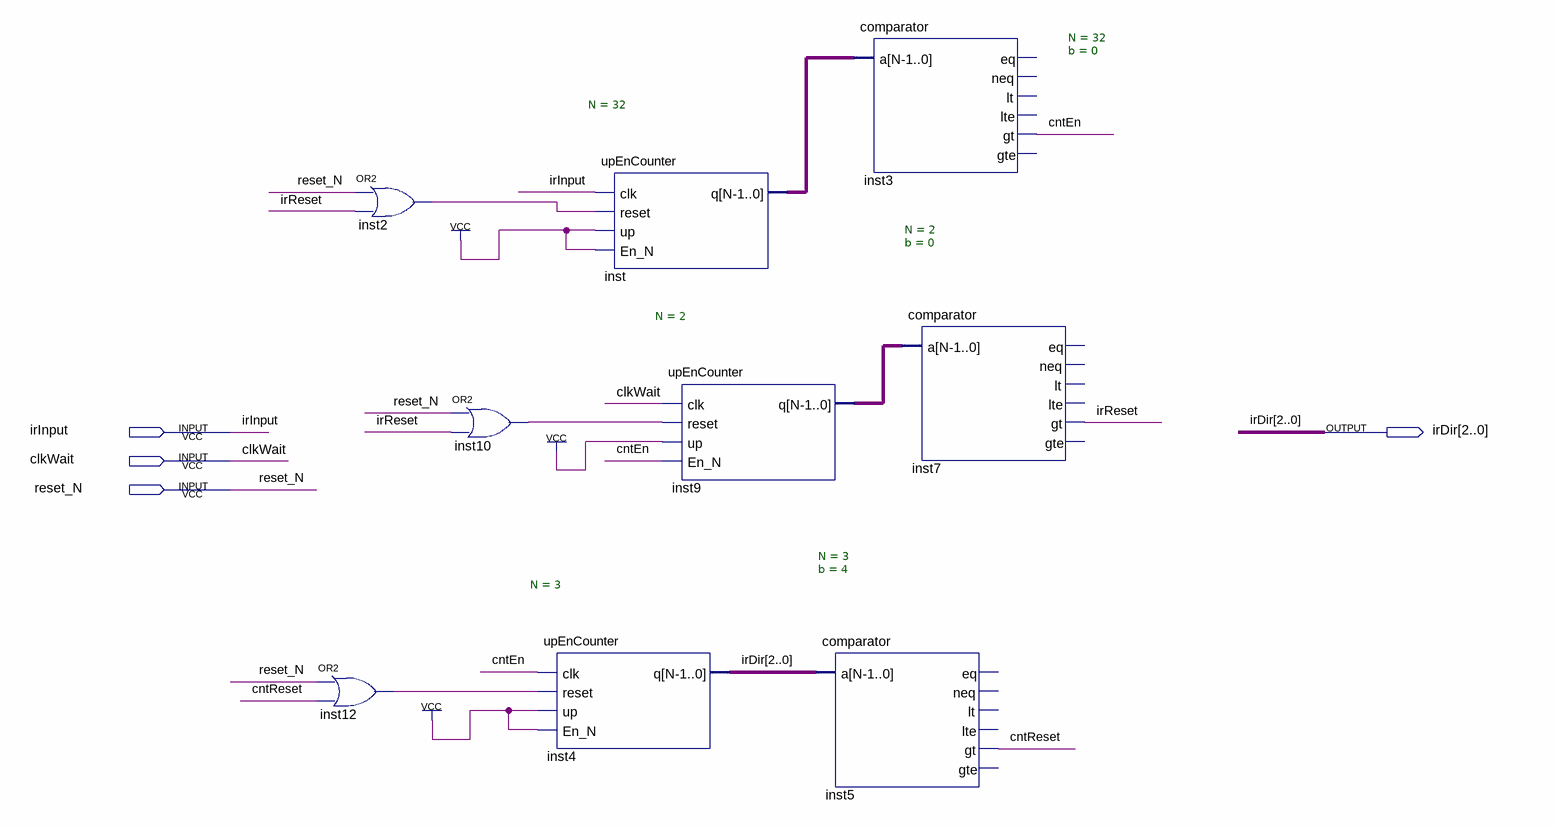
[diagram p0: schematic sheet]
// Quartus schematic irModuleSimple.bdf as structural Verilog: 9 symbols, 4 pins
module irModuleSimple (
  input  irInput,
  input  clkWait,
  input  reset_N,
  output [2:0] irDir
);

  wire cntEn, cntReset, inst2_out, inst10_out, inst12_out, irReset;
  wire [1:0] inst9_q;
  wire [31:0] inst_q;

  or inst12 (inst12_out, reset_N, cntReset);
  or inst2 (inst2_out, reset_N, irReset);
  or inst10 (inst10_out, reset_N, irReset);
  upEnCounter #(.N(3)) inst4 (.clk(cntEn), .reset(inst12_out), .up(1'b1), .En_N(1'b1), .q(irDir));
  upEnCounter #(.N(32)) inst (.clk(irInput), .reset(inst2_out), .up(1'b1), .En_N(1'b1), .q(inst_q));
  upEnCounter #(.N(2)) inst9 (.clk(clkWait), .reset(inst10_out), .up(1'b1), .En_N(cntEn), .q(inst9_q));
  comparator #(.N(32), .b(0)) inst3 (.a(inst_q), .gt(cntEn));  // open: eq, neq, lt, lte, gte
  comparator #(.N(3), .b(4)) inst5 (.a(irDir), .gt(cntReset));  // open: eq, neq, lt, lte, gte
  comparator #(.N(2), .b(0)) inst7 (.a(inst9_q), .gt(irReset));  // open: eq, neq, lt, lte, gte
endmodule
